# Altium schematic sheet Cover Sheet.SchDoc: Cover Sheet
size Tabloid; SheetNumber: 1; SheetTotal: 6
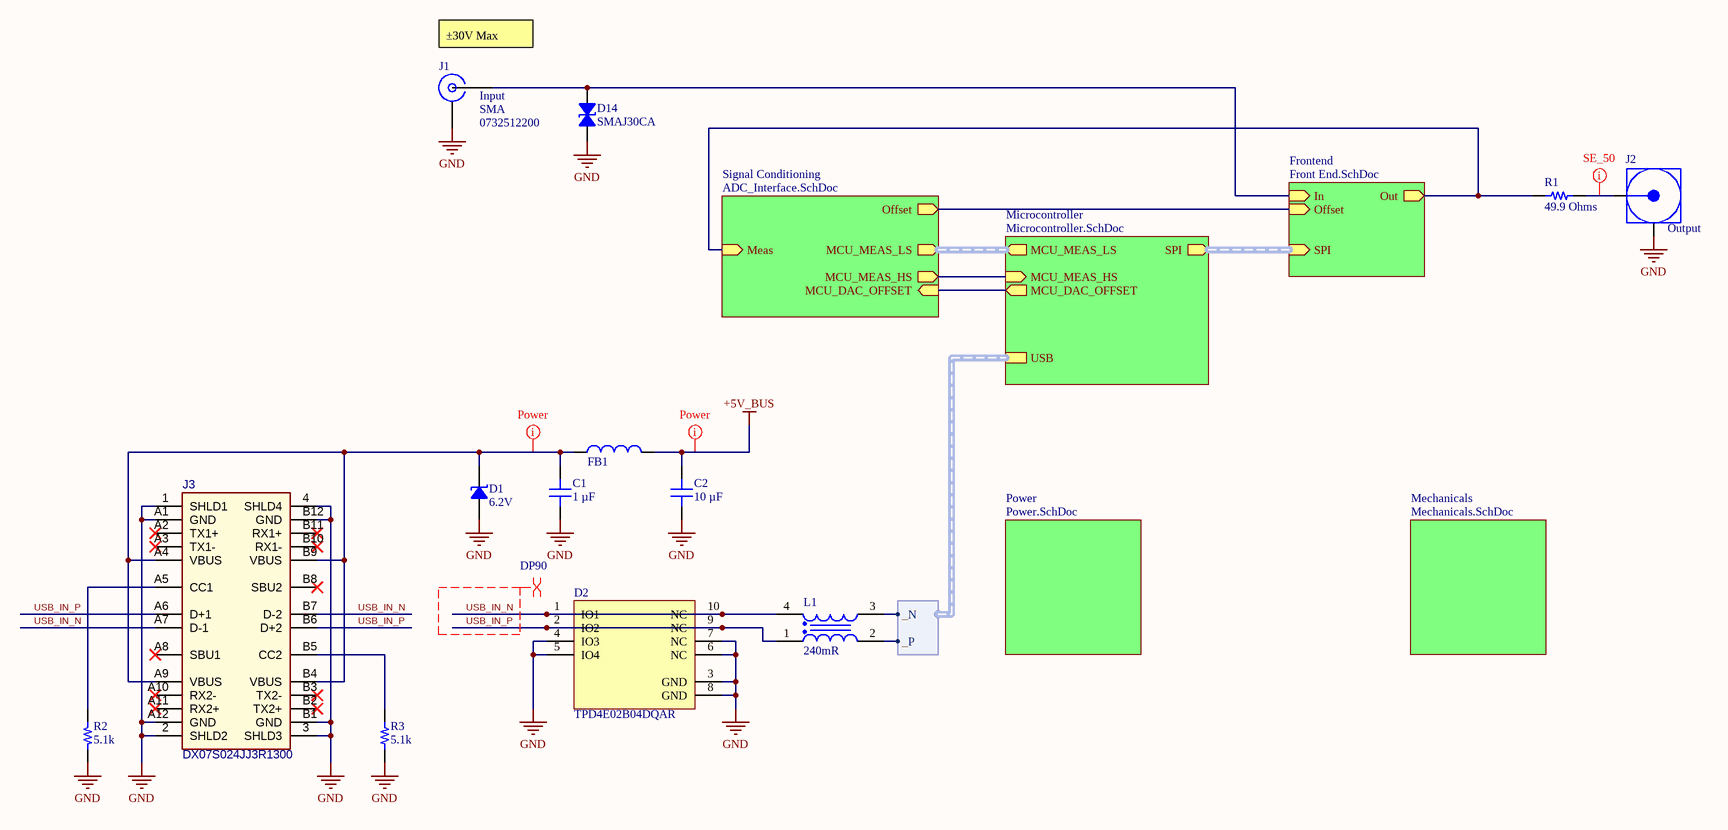
[diagram p0: Cover Sheet.SchDoc]

## Parts
C1  1 µF  [CAP 0402_1005]
C2  10 µF  [CAP 0805_2012]
D1  Voltage - Breakdown (Min): 6.2V  [SOD323]  (hidden comment: D5V0S1U2WS-7)
D2  TPD4E02B04DQAR  [FP-DQA0010A-MFG]
D14  SMAJ30CA  [DO214AC SMA]
FB1  74279226101  [WE-MPSB_1812_L4.5W3.2H2.3]  (value not drawn)
J1  Input  Connector Style: SMA  Part Number: 0732512200  [MOLEX SD-73251-220 (NICKEL, 2.79MM FEET)]
J2  Output  [TE - 5227161-3]
J3  DX07S024JJ3R1300  [JAE-DX07S024JJ3_V]
L1  value 240mR  [WE-CNSW HF_0805]  (hidden comment: 744233670)
R1  49.9 Ohms  [RES 0805_2012]
R2  5.1k  [RES 0402_1005]
R3  5.1k  [RES 0402_1005]

## Sub-sheets
Frontend = Front End.SchDoc: SPI (in, harness SPI), Out (out), In (in), Offset (in)
Mechanicals = Mechanicals.SchDoc: no entries
Microcontroller = Microcontroller.SchDoc: SPI (out, harness SPI), MCU_DAC_OFFSET (out), MCU_MEAS_LS (out, harness DP), MCU_MEAS_HS (in), USB (harness DP)
Power = Power.SchDoc: no entries
Signal Conditioning = ADC_Interface.SchDoc: Meas (in), MCU_DAC_OFFSET (in), MCU_MEAS_LS (out, harness DP), MCU_MEAS_HS (out), Offset (out)

## Harnesses
DP: _P, _N

## Nets
+5V_BUS: C2.2 FB1.1
GND: C1.1 C2.1 D1.1 D2.3(GND) D2.4(IO3) D2.5(IO4) D2.6(NC) D2.7(NC) D2.8(GND) D14.1 J1.G(GND) J2.G(GND) J3.1(SHLD1) J3.2(SHLD2) J3.3(SHLD3) J3.4(SHLD4) J3.A1(GND) J3.A12(GND) J3.B1(GND) J3.B12(GND) R2.1 R3.1
USB_IN_N: D2.1(IO1) D2.10(NC) J3.A7(D-1) J3.B7(D-2) L1.4
USB_IN_P: D2.2(IO2) D2.9(NC) J3.A6(D+1) J3.B6(D+2) L1.1
NetC1_2: C1.2 D1.2 FB1.2 J3.A4(VBUS) J3.A9(VBUS) J3.B4(VBUS) J3.B9(VBUS)
NetD14_2: D14.2 J1.S(SIGNAL) ; sheet Frontend/In
NetJ2_S: J2.S(Signal) R1.2
NetJ3_A5: J3.A5(CC1) R2.2
NetJ3_B5: J3.B5(CC2) R3.2
NetL1_2: L1.2 ; sheet Microcontroller/USB._P
NetL1_3: L1.3 ; sheet Microcontroller/USB._N
NetR1_1: R1.1 ; sheet Frontend/Out, sheet Signal Conditioning/Meas
(unnamed): sheet Frontend/Offset, sheet Signal Conditioning/Offset
(unnamed): sheet Microcontroller/MCU_DAC_OFFSET, sheet Signal Conditioning/MCU_DAC_OFFSET
(unnamed): sheet Microcontroller/MCU_MEAS_HS, sheet Signal Conditioning/MCU_MEAS_HS

Not connected (* = marked no-connect by the designer): J3 A2(TX1+)* A3(TX1-)* A8(SBU1)* A10(RX2-)* A11(RX2+)* B2(TX2+)* B3(TX2-)* B8(SBU2)* B10(RX1-)* B11(RX1+)*

## Buses and harness runs
harness sheet Frontend/SPI = sheet Microcontroller/SPI
harness sheet Microcontroller/MCU_MEAS_LS = sheet Signal Conditioning/MCU_MEAS_LS

## Layout directives
net class Power: +5V_BUS, NetC1_2
differential pair; differential pair class DP90: USB_IN_N, USB_IN_P
net class SE_50: NetJ2_S

## Notes on the sheet
- (near J1) ±30V Max

## Library data of the parts
C1 = CL05A105KO5NNNC: CAP CER 1UF 16V X5R 0402; manufacturer: Samsung Electro-Mechanics; Tolerance: ±10%; Part Number: CL05A105KO5NNNC; Value: 1 µF; Applications: General Purpose; Capacitance: 1 µF; componentlink1description: Datasheet; componentlink1url: http://www.samsungsem.com/kr/support/product-search/mlcc/CL05A105KO5NNNC.jsp; componentlink2description: DigiKey Link; componentlink2url: https://www.digikey.com/en/products/detail/samsung-electro-mechanics/CL05A105KO5NNNC/3886725; Device Package: 0402 (1005 Metric); lastupdated: 2/9/2024 8:04:35 PM; Lifecycle Status: Active; Minimum Order: 1; Mounting Type: Surface Mount, MLCC; Operating Temperature: -55°C ~ 85°C; Package / Case: 0402 (1005 Metric); packaging: TapeAndReel; partid: 3120; Part Status: Active; price: 0.01; series: CL; Size / Dimension: 0.039" L x 0.020" W (1.00mm x 0.50mm); Supplier 1: DigiKey; Supplier Part Number 1: 1276-1067-1-ND; Temperature Coefficient: X5R; Thickness (Max): 0.022" (0.55mm); Voltage - Rated: 16V
C2 = GCM21BC71E106KE36L: CAP CER 10UF 25V X7S 0805; manufacturer: Murata Electronics; Tolerance: ±10%; Part Number: GCM21BC71E106KE36L; Value: 10 µF; Applications: Automotive; Capacitance: 10 µF; componentlink1description: Datasheet; componentlink1url: https://search.murata.co.jp/Ceramy/image/img/A01X/G101/ENG/GCM21BC71E106KE36-01A.pdf; componentlink2description: DigiKey Link; componentlink2url: https://www.digikey.com/en/products/detail/murata-electronics/GCM21BC71E106KE36L/16821116; Device Package: 0805 (2012 Metric); lastupdated: 2/9/2024 8:14:44 PM; Lifecycle Status: Active; Minimum Order: 1; Mounting Type: Surface Mount, MLCC; Operating Temperature: -55°C ~ 125°C; Package / Case: 0805 (2012 Metric); packaging: TapeAndReel; partid: 48794; Part Status: Active; price: 0.09; Ratings: AEC-Q200; series: GCM; Size / Dimension: 0.079" L x 0.049" W (2.00mm x 1.25mm); Supplier 1: DigiKey; Supplier Part Number 1: 490-GCM21BC71E106KE36LCT-ND; Temperature Coefficient: X7S; Thickness (Max): 0.057" (1.45mm); Voltage - Rated: 25V
D1 = D5V0S1U2WS-7: TVS DIODE 5.5V 16V SOD323; Manufacturer: Diodes Incorporated; Capacitance @ Frequency: 950pF @ 1MHz; Current - Peak Pulse (10/1000µs): 70A (8/20µs); Power Line Protection: No; Power - Peak Pulse: 1000W (1kW); Type: Zener; Unidirectional Channels: 1; Voltage - Reverse Standoff (Typ): 5.5V (Max); Part Number: D5V0S1U2WS-7; Applications: Automotive; ComponentLink1Description: Datasheet; ComponentLink1URL: https://www.diodes.com/assets/Datasheets/D5V0S1U2WS.pdf; ComponentLink2Description: DigiKey Link; ComponentLink2URL: http://digikey.com/product-detail/en/diodes-incorporated/D5V0S1U2WS-7/31-D5V0S1U2WS-7CT-ND/11643340; LastUpdated: 8/30/2020 9:07:50 PM; Lifecycle Status: Active; Minimum Order: 1; Mounting Type: Surface Mount; Package / Case: SC-76, SOD-323; Packaging: CutTape; PartId: 11491; Price: 0.37; Series: Automotive, AEC-Q101; Supplier 1: DigiKey; Supplier Part Number 1: 31-D5V0S1U2WS-7CT-ND; Supplier Device Package: SOD-323; Voltage - Clamping (Max) @ Ipp: 16V
D2 = CMP-004-00031-2: Quad 0.25-pF, ±3.6-V, ±12-kV ESD protection diode for USB 3.0, HDMI 2.0 & High Speed Signals; Interface: USB,HDMI; Number of Bidirectional Channels: 4; Min Breakdown Voltage: 5.5V; Power Line Protection: No; Peak Pulse Power: 17W; Diode Type: ZENER; Peak Pulse Current: 5A; Breakdown Voltage: 6.4V; Direction: Bidirectional; Operating Supply Voltage: 3.6V; RoHS Compliant: Yes; Reach SVHC Compliant: No; Pins: 10; Number of Channels: 4; ComponentLink1URL: https://www.ti.com/lit/ds/symlink/tpd4e02b04.pdf; Packaging: Cut Tape; Mounting Technology: Surface Mount; Max Operating Temperature: 125°C; Width: 1mm; Thickness: 500um; Length: 2.5mm; Lead Free: Lead Free; ComponentLink1Description: Datasheet; Min Operating Temperature: -40°C; Series: -; Reverse Standoff Voltage: 3.6V; Height: 550um
D14 = SMAJ30CA: TVS DIODE 30VWM 48.4VC DO214AC; Manufacturer: Littelfuse Inc.; Bidirectional Channels: 1; Current - Peak Pulse (10/1000µs): 8.3A; Power Line Protection: No; Power - Peak Pulse: 400W; Type: Zener; Voltage - Breakdown (Min): 33.3V; Voltage - Clamping (Max) @ Ipp: 48.4V; Voltage - Reverse Standoff (Typ): 30V; Part Number: SMAJ30CA; Applications: General Purpose; ComponentLink1Description: Datasheet; ComponentLink1URL: https://www.littelfuse.com/~/media/electronics/datasheets/tvs_diodes/littelfuse_tvs_diode_smaj_datasheet.pdf.pdf; ComponentLink2Description: DigiKey Link; ComponentLink2URL: https://www.digikey.com/en/products/detail/littelfuse-inc/SMAJ30CA/762295; LastUpdated: 6/3/2024 8:21:17 PM; Lifecycle Status: Active; Minimum Order: 1; Mounting Type: Surface Mount; Operating Temperature: -65°C ~ 150°C (TJ); Package / Case: DO-214AC, SMA; Packaging: TapeAndReel; PartId: 7378; Part Status: Active; Price: 0.08; Series: SMAJ; Supplier 1: DigiKey; Supplier Part Number 1: SMAJ30CALFCT-ND; Supplier Device Package: DO-214AC (SMA)
FB1 = CMP-000000-2: Ferrite Beads Multi-Layer Power 100Ohm 25% 100MHz 8A 0.006Ohm DCR 1812 Automotive T/R; Impedance: 100R; Number of Lines: 1; Termination: SMD/SMT; Width: 3.2mm; Max Current Rating: 8A; Max DC Current: 8A; Package Quantity: 2500; ComponentLink1URL: https://www.we-online.com/components/products/datasheet/74279226101.pdf; Packaging: Cut Tape; Mounting Technology: Surface Mount; Max Operating Temperature: 125°C; Case/Package: 1812; Case Code (Imperial): 1812; RoHS Compliant: Yes; Test Frequency: 100MHz; Min Operating Temperature: -55°C; Lead Free: Lead Free; Tolerance: 25%; ComponentLink1Description: Datasheet; Series: WE-MPSB; Weight: 0.000952oz; Length: 4.5mm; Case Code (Metric): 4532; Height: 2.3mm
J1 = 0732512200: CONN SMA JACK R/A 50 OHM PCB; Manufacturer: Molex; Connector Type: Jack, Female Socket; Contact Termination: Solder; Frequency - Max: 18GHz; Impedance: 50Ohm; Number of Ports: 1; ComponentLink1Description: Datasheet; ComponentLink1URL: https://www.molex.com/pdm_docs/ps/PS-89675-346.pdf; ComponentLink2Description: DigiKey Link; ComponentLink2URL: http://digikey.com/product-detail/en/molex/0732512200/WM9352-ND/3468838; Fastening Type: Threaded; Housing Color: Silver; LastUpdated: 6/29/2022 6:13:17 PM; Lifecycle Status: Active; Minimum Order: 1; Mounting Feature: Bulkhead - Front Side Nut; Mounting Type: Panel Mount, Through Hole, Right Angle; Packaging: Bulk; Part Status: Active; Price: 5.75; Series: 73251; Shield Termination: Solder; Supplier 1: DigiKey; Supplier Part Number 1: WM9352-ND
J2 = CMP-002-00083-2: RF BNC Connector, 1 Contact(s), Female, Panel Mount, Solder Terminal, Locking, Jack; pin to pad: G>2 S>1; Sealable: No (Without); Number of Positions: 1; Voltage Rating: 500V; PCB Mounting Orientation: Right Angle; Operating Frequency: 0 to 4 GHz; Insulation Resistance: 5GR; Frequency: 4GHz; Body Material: Zinc; Dielectric Material: Polymethylpentene; PCB Mount Retention: With; Body Plating: Nickel; Impedance: 50R; Connector Type: BNC,Jack; Polarity: Standard,Normal; Packaging: Rail/Tube; Reach SVHC Compliant: No; Height: 15.88mm; Min Operating Temperature: -55°C; Mounting Technology: Panel; Orientation: Right Angle; Gender: Female; Fastening Type: Bayonet; ComponentLink1URL: https://www.te.com/commerce/DocumentDelivery/DDEController?Action=showdoc&DocId=Customer+Drawing%7F5227161%7FB4%7Fpdf%7FEnglish%7FENG_CD_5227161_B4.pdf%7F5227161-3; Radiation Hardening: No; Termination: Through Hole; Length: 14.76mm; Contact Plating: Gold; Package Quantity: 35; ComponentLink1Description: Datasheet; Max Operating Temperature: 85°C; Color: White; Housing Color: White; Insulation Material: Polymethylpentene; Contact Material: Bronze; Series: BNC; Clock Frequency: 4GHz; Depth: 14.76mm
J3 = CMP-002-00065-3: USB-C Connector, 20 V, 1.25 A, -30 to 80 degC, RoHS, Tape and Reel; Gender: Receptacle; Pins: 28; Connector Type: USB-C
L1 = CMP-006-00022-3: WE-CNSW HF SMT Common Mode Line Filter (High Frequ; Impedance: 67R; Current: 320mA; Number of Lines: 2; Operating Frequency: 10  1000MHz; Tolerance: 25%; Voltage Rating (AC): 50V; Test Frequency: 100MHz; Frequency: 6.5GHz; Lead Free: Lead Free; Packaging: Tape and Reel; RoHS Compliant: Yes; Max Operating Temperature: 105°C; Mounting Technology: Surface Mount; Width: 0.85mm; ComponentLink1Description: Datasheet; Reach SVHC Compliant: No; Case/Package: 0805; Max DC Current: 320mA; Pins: 4; Voltage Rating: 50V; ComponentLink1URL: https://www.we-online.com/components/products/datasheet/744233670.pdf; Min Operating Temperature: -40°C; Current Rating: 320mA; Depth: 1.2mm; DC Resistance (DCR): 240mR; Termination: SMD/SMT; Package Quantity: 1; Voltage Rating (DC): 50V; Length: 0.079inch; Max Current Rating: 320mA; Series: WE-CNSW; Height: 0.055inch
R1 = CRCW080549R9FKEAHP: RES SMD 49.9 OHM 1% 1/2W 0805; Manufacturer: Vishay Dale; Power (Watts): 0.5W, 1/2W; Temperature Coefficient: ±100ppm/°C; Part Number: CRCW080549R9FKEAHP; Value: 49.9 Ohms; ComponentLink1Description: Datasheet; ComponentLink1URL: http://www.vishay.com/docs/20043/crcwhpe3.pdf; ComponentLink2Description: DigiKey Link; ComponentLink2URL: https://www.digikey.com/en/products/detail/vishay-dale/CRCW080549R9FKEAHP/2222324; Composition: Thick Film; Device Package: 0805 (2012 Metric); Features: Automotive AEC-Q200, Pulse Withstanding; Height - Seated (Max): 0.020" (0.50mm); LastUpdated: 2/8/2024 9:02:28 PM; Lifecycle Status: Active; Minimum Order: 1; Number of Terminations: 2; Operating Temperature: -55°C ~ 155°C; Package / Case: 0805 (2012 Metric); Packaging: TapeAndReel; PartId: 30317; Part Status: Active; Price: 0.02; Ratings: AEC-Q200; Resistance: 49.9 Ohms; Series: CRCW-HP; Size / Dimension: 0.079" L x 0.049" W (2.00mm x 1.25mm); Supplier 1: DigiKey; Supplier Part Number 1: 541-49.9TCT-ND; Supplier Device Package: 0805; Tolerance: ±1%
R2 R3 = CRCW04025K10FKEDC: RES 5.1K OHM 1% 1/16W 0402; Manufacturer: Vishay Dale; Value: 5.1 kOhms; Power (Watts): 0.063W, 1/16W; Temperature Coefficient: ±100ppm/°C; Part Number: CRCW04025K10FKEDC; ComponentLink1Description: Datasheet; ComponentLink1URL: http://www.vishay.com/docs/28773/crcwce3.pdf; ComponentLink2Description: DigiKey Link; ComponentLink2URL: https://www.digikey.com/en/products/detail/vishay-dale/CRCW04025K10FKEDC/7928491; Composition: Thick Film; Device Package: 0402 (1005 Metric); Height - Seated (Max): 0.014" (0.35mm); LastUpdated: 2/9/2024 8:29:38 PM; Lifecycle Status: Active; Minimum Order: 1; Number of Terminations: 2; Operating Temperature: -55°C ~ 155°C; Package / Case: 0402 (1005 Metric); Packaging: CutTape; PartId: 16137; Part Status: Active; Price: 0.01; Resistance: 5.1 kOhms; Series: CRCW-C; Size / Dimension: 0.039" L x 0.020" W (1.00mm x 0.50mm); Supplier 1: DigiKey; Supplier Part Number 1: 541-4069-1-ND; Supplier Device Package: 0402; Tolerance: ±1%